# Altium schematic sheet Quadrotor.SchDoc
size A
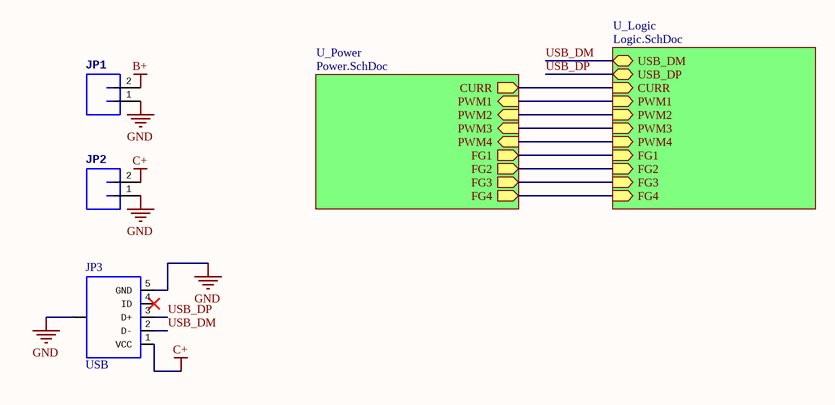
[diagram p0: Quadrotor.SchDoc]

## Parts
JP1  (no value)  [JST-2-PTH-VERT]
JP2  (no value)  [JST-2-PTH-VERT]
JP3  USB  [USB-MICROB]

## Sub-sheets
U_Logic = Logic.SchDoc: USB_DM (bidir), USB_DP (bidir), CURR (in), PWM1 (in), PWM2 (in), PWM3 (in), PWM4 (in), FG1 (in), FG2 (in), FG3 (in), FG4 (in)
U_Power = Power.SchDoc: PWM1 (in), PWM2 (in), PWM3 (in), PWM4 (in), FG1 (out), FG2 (out), FG3 (out), FG4 (out), CURR (out)

## Nets
B+: JP1.2
C+: JP2.2 JP3.1(VCC)
GND: JP1.1 JP2.1 JP3.5(GND) JP3.6(SHIELD)
USB_DM: JP3.2(D-) ; sheet U_Logic/USB_DM
USB_DP: JP3.3(D+) ; sheet U_Logic/USB_DP
(unnamed): sheet U_Logic/CURR, sheet U_Power/CURR
(unnamed): sheet U_Logic/PWM1, sheet U_Power/PWM1
(unnamed): sheet U_Logic/PWM2, sheet U_Power/PWM2
(unnamed): sheet U_Logic/PWM3, sheet U_Power/PWM3
(unnamed): sheet U_Logic/PWM4, sheet U_Power/PWM4
(unnamed): sheet U_Logic/FG1, sheet U_Power/FG1
(unnamed): sheet U_Logic/FG2, sheet U_Power/FG2
(unnamed): sheet U_Logic/FG3, sheet U_Power/FG3
(unnamed): sheet U_Logic/FG4, sheet U_Power/FG4

Not connected (* = marked no-connect by the designer): JP3 4(ID)*

## Library data of the parts
JP1 JP2 = JST_2_RIGHT
JP3 = USB_MICROB_PLUG-SMT: pin to pad: 1>VBUS 2>D- 3>D+ 4>ID 5>GND 6>MT1+P$1+P$2+MT2; PROD_ID: CONN-09900